# Altium schematic sheet CindyLou Main Board copy_2023-08-16.schdoc
size 600 x 358 mm
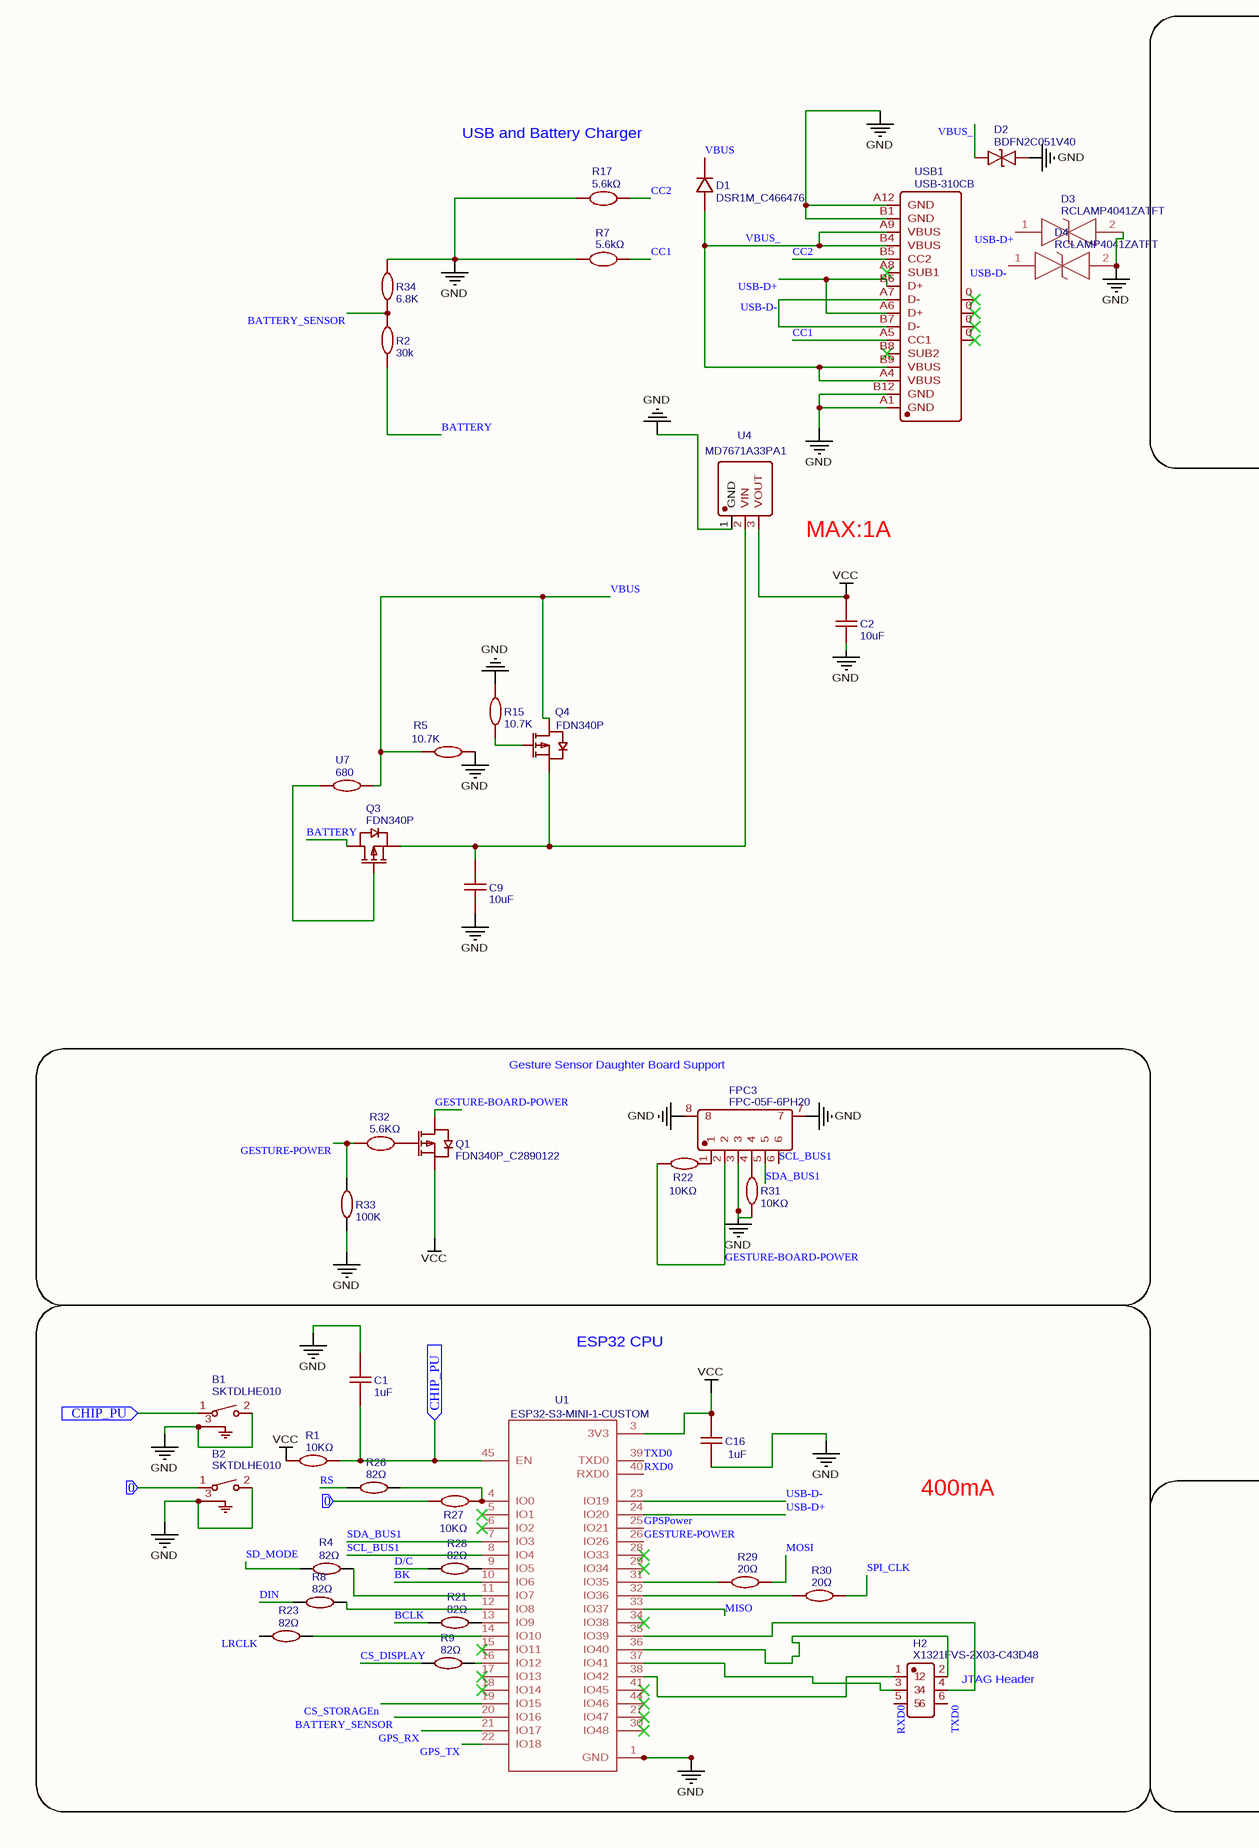
[diagram p0: CindyLou Main Board copy_2023-08-16.schdoc, left]
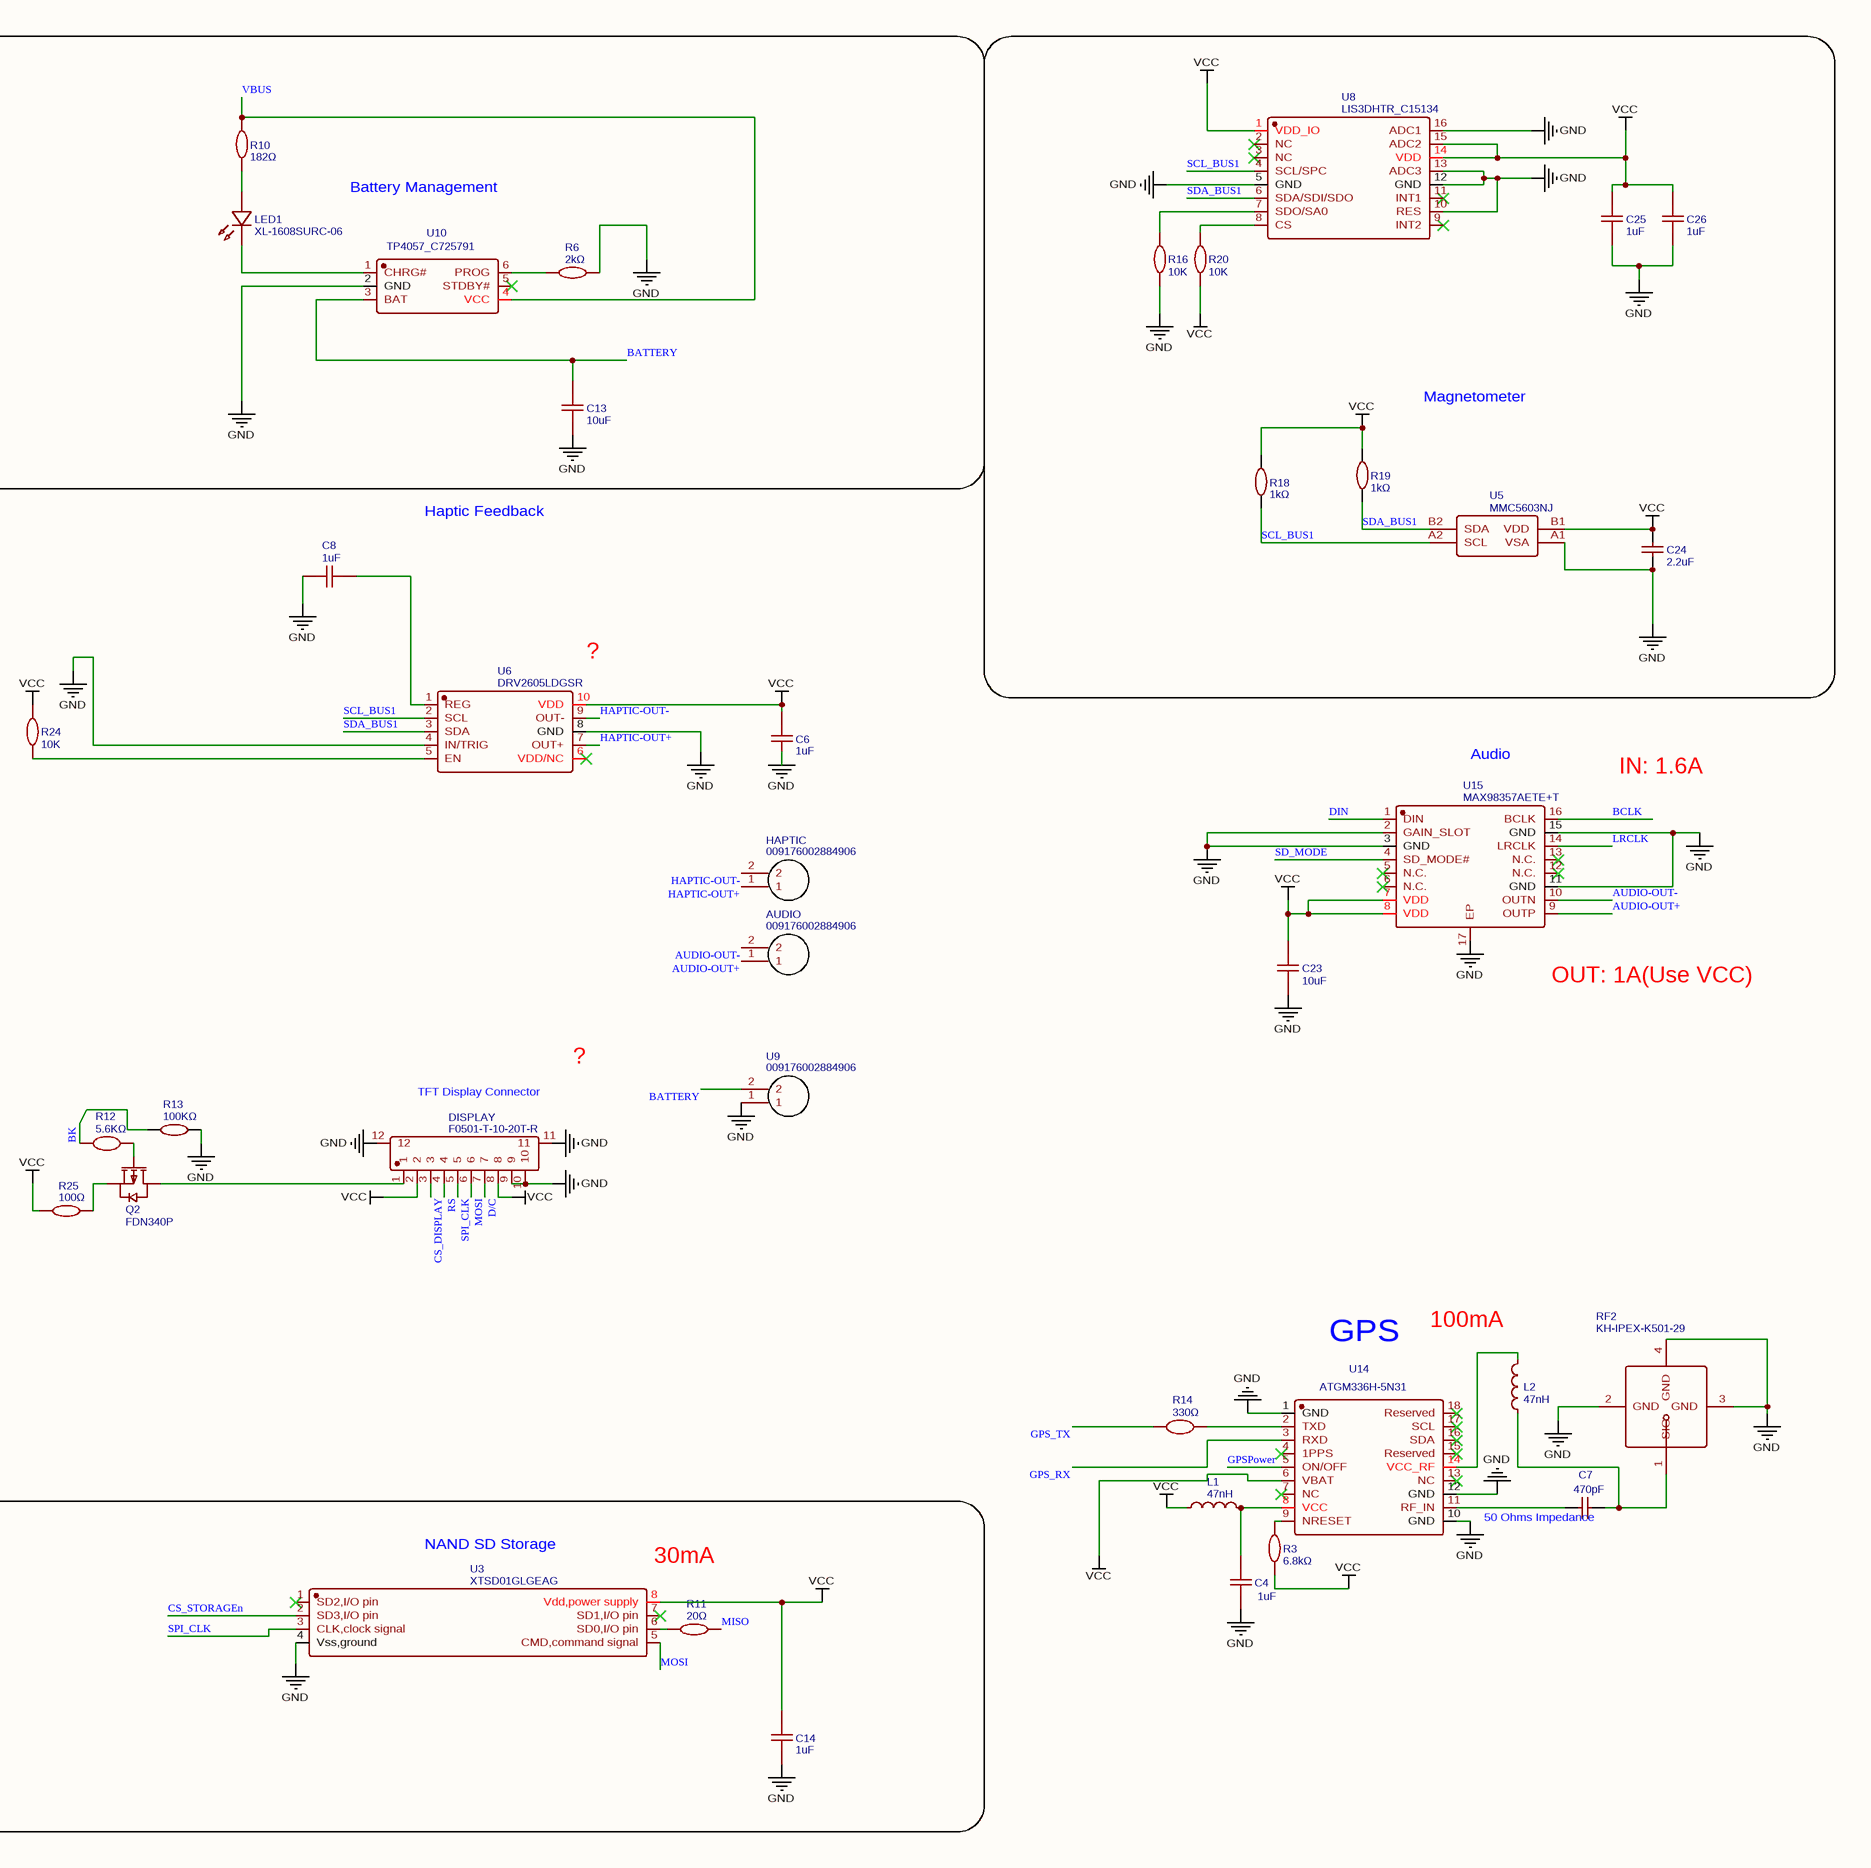
[diagram p1: CindyLou Main Board copy_2023-08-16.schdoc, right]

## Parts
AUDIO  009176002884906  [009176002884906]
B1  SKTDLHE010  [KEY-SMD_SKTDLHE010]
B2  SKTDLHE010  [KEY-SMD_SKTDLHE010]
C1  1uF  [C0402]
C2  10uF  [C0402]
C4  1uF  [C0402]
C6  1uF  [C0402]
C7  470pF  [C0201]
C8  1uF  [C0201]
C9  10uF  [C0402]
C13  10uF  [C0402]
C14  1uF  [C0402]
C16  1uF  [C0402]
C23  10uF  [C0402]
C24  2.2uF  [C0402]
C25  1uF  [C0402]
C26  1uF  [C0402]
D1  DSR1M_C466476  [SOD-123FL_L2.8-W1.8-LS3.7-RD]
D2  BDFN2C051V40  [DFN-SMD_L1.0-W0.6-BI]
D3  RCLAMP4041ZATFT  [RCLAMP4021ZATFT]
D4  RCLAMP4041ZATFT  [RCLAMP4021ZATFT]
DISPLAY  F0501-T-10-20T-R  [FPC-SMD_F0501-T-10-20T-R]
FPC3  FPC-05F-6PH20  [FPC-SMD_6P-P0.50_XUNPU_FPC-05F-6PH20]
H2  X1321FVS-2X03-C43D48  [HDR-SMD_6P-P1.27-V-F-R2-C3-LS4.8]
HAPTIC  009176002884906  [009176002884906]
L1  47nH  [L0201]
L2  47nH  [L0201]
LED1  XL-1608SURC-06  [LED0603-RD_RED]
Q1  FDN340P_C2890122  [SOT-23-3_L2.9-W1.3-P1.90-LS2.4-BR]
Q2  FDN340P  [SOT-23-3_L2.9-W1.3-P1.90-LS2.4-BR]
Q3  FDN340P  [SOT-23-3_L2.9-W1.3-P1.90-LS2.4-BR]
Q4  FDN340P  [SOT-23-3_L2.9-W1.3-P1.90-LS2.4-BR]
R1  10KΩ  [R0402]
R2  30k  [R0402]
R3  6.8kΩ  [R0402]
R4  82Ω  [R0201]
R5  10.7K  [R0402]
R6  2kΩ  [R0201]
R7  5.6kΩ  [R0201]
R8  82Ω  [R0201]
R9  82Ω  [R0201]
R10  182Ω  [R0402]
R11  20Ω  [R0201]
R12  5.6KΩ  [R0402]
R13  100KΩ  [R0402]
R14  330Ω  [R0201]
R15  10.7K  [R0402]
R16  10K  [R0402]
R17  5.6kΩ  [R0201]
R18  1kΩ  [R0402]
R19  1kΩ  [R0402]
R20  10K  [R0402]
R21  82Ω  [R0201]
R22  10KΩ  [R0402]
R23  82Ω  [R0201]
R24  10K  [R0402]
R25  100Ω  [R0402]
R26  82Ω  [R0201]
R27  10KΩ  [R0402]
R28  82Ω  [R0201]
R29  20Ω  [R0201]
R30  20Ω  [R0201]
R31  10KΩ  [R0402]
R32  5.6KΩ  [R0402]
R33  100K  [R0402]
R34  6.8K  [R0402]
RF2  KH-IPEX-K501-29  [ANT-SMD_KH-IPEX-K501-29]
U1  ESP32-S3-MINI-1-CUSTOM  [XCVR_ESP32-S3-MINI-1-N8-CUSTOM]
U3  XTSD01GLGEAG  [LGA-8_L6.0-W8.0-P1.27-BL]
U4  MD7671A33PA1  [SOT-89-3_L4.5-W2.5-P1.50-LS4.2-BR]
U5  MMC5603NJ  [FLIPCHIP-4_L0.8-W0.8-R2-C2-P0.40-TL]
U6  DRV2605LDGSR  [VSSOP-10_L3.0-W3.0-P0.50-LS4.9-BL]
U7  680  [R0402]
U8  LIS3DHTR_C15134  [LGA-16_L3.0-W3.0-P0.50-TL]
U9  009176002884906  [009176002884906]
U10  TP4057_C725791  [SOT-23-6_L2.9-W1.6-P0.95-LS2.8-BR]
U14  ATGM336H-5N31  [GPSM-SMD_ATGM336H-TR]
U15  MAX98357AETE+T  [TQFN-16_L3.0-W3.0-P0.50-BL-EP1.5]
USB1  USB-310CB  [USB-C-SMD_20P-P0.50-L6.5-W11.2]

## Blocks framed on the sheet
Battery Management: C13 LED1 R6 R10 U10
Magnetometer: C24-C26 R16 R18-R20 U5 U8
Gesture Sensor Daughter Board Support: FPC3 Q1 R22 R31-R33
400mA: B1 B2 C1 C16 H2 R1 R4 R8 R9 R21 R23 R26-R30 U1
30mA: C14 R11 U3

## Ports
0 (in), CHIP_PU (in)

## Nets
GND: B1.2 B1.3(GND) B2.2 B2.3(GND) C1.2 C2.2 C4.1 C6.1 C8.1 C9.1 C13.1 C14.1 C16.1 C23.1 C24.1 C25.1 C26.1 D2.2 D3.2 D4.2 DISPLAY.9 DISPLAY.10 DISPLAY.11 DISPLAY.12 FPC3.3 FPC3.7 FPC3.8 R5.2 R6.2 R7.1 R13.1 R15.2 R16.1 R17.2 R31.1 R33.1 R34.2 RF2.2(GND) RF2.3(GND) RF2.4(GND) U1.1(GND) U1.2(GND) U1.42(GND) U1.43(GND) U1.46(GND) U1.47(GND) U1.48(GND) U1.49(GND) U1.50(GND) U1.51(GND) U1.52(GND) U1.53(GND) U1.54(GND) U1.55(GND) U1.56(GND) U1.57(GND) U1.58(GND) U1.59(GND) U1.60(GND) U1.62(GND) U1.63(GND) U1.64(GND) U1.65(GND) U3.4(Vss,ground) U4.1(GND) U5.A1(VSA) U6.4(IN/TRIG) U6.8(GND) U8.5(GND) U8.10(RES) U8.12(GND) U8.13(ADC3) U8.16(ADC1) U9.1 U10.2(GND) U14.1(GND) U14.10(GND) U14.12(GND) U15.2(GAIN_SLOT) U15.3(GND) U15.11(GND) U15.15(GND) U15.17(EP) USB1.A1(GND) USB1.A12(GND) USB1.B1(GND) USB1.B12(GND)
VCC: C2.1 C6.2 C14.2 C16.2 C23.2 C24.2 C25.2 C26.2 DISPLAY.2 DISPLAY.8 L1.1 Q1.2(S) R1.1 R3.1 R18.2 R19.2 R20.1 R24.2 R25.1 U1.3(3V3) U3.8(Vdd,power_supply) U4.3(VOUT) U5.B1(VDD) U6.10(VDD) U8.1(VDD_IO) U8.14(VDD) U8.15(ADC2) U14.6(VBAT) U15.7(VDD) U15.8(VDD)
0: B2.1 R27.1 ; port 0
AUDIO-OUT+: AUDIO.1 U15.9(OUTP)
AUDIO-OUT-: AUDIO.2 U15.10(OUTN)
BATTERY: C13.2 Q3.3(D) R2.1 U9.2 U10.3(BAT)
BATTERY_SENSOR: R2.2 R34.1 U1.20(IO16)
BCLK: R21.1 U15.16(BCLK)
BK: R12.1 R13.2 U1.10(IO6)
CC1: R7.2 USB1.A5(CC1)
CC2: R17.1 USB1.B5(CC2)
CHIP_PU: B1.1 C1.1 R1.2 U1.45(EN) ; port CHIP_PU
CS_DISPLAY: DISPLAY.3 R9.1
CS_STORAGEn: U1.19(IO15) U3.2(SD3,I/O_pin)
D/C: DISPLAY.7 R28.1
DIN: R8.1 U15.1(DIN)
GESTURE-BOARD-POWER: FPC3.2 Q1.3(D) R22.1
GESTURE-POWER: R32.1 R33.2 U1.26(IO26)
GPS_RX: U1.21(IO17) U14.3(RXD)
GPS_TX: R14.1 U1.22(IO18)
GPSPower: U1.25(IO21) U14.5(ON/OFF)
HAPTIC-OUT+: HAPTIC.1 U6.7(OUT+)
HAPTIC-OUT-: HAPTIC.2 U6.9(OUT-)
LRCLK: R23.1 U15.14(LRCLK)
MISO: R11.2 U1.33(IO37)
MOSI: DISPLAY.6 R29.2 U3.5(CMD,command_signal)
RS: DISPLAY.4 R26.1
RXD0: H2.5 U1.40(RXD0)
SCL_BUS1: FPC3.6 R18.1 U1.8(IO4) U5.A2(SCL) U6.2(SCL) U8.4(SCL/SPC)
SD_MODE: R4.1 U15.4(SD_MODE#)
SDA_BUS1: FPC3.5 R19.1 U1.7(IO3) U5.B2(SDA) U6.3(SDA) U8.6(SDA/SDI/SDO)
SPI_CLK: DISPLAY.5 R30.2 U3.3(CLK,clock_signal)
TXD0: H2.6 U1.39(TXD0)
USB-D+: D3.1 U1.24(IO20) USB1.A6(D+) USB1.B6(D+)
USB-D-: D4.1 U1.23(IO19) USB1.A7(D-) USB1.B7(D-)
VBUS: D1.1(K) Q4.3(D) R5.1 R10.2 U7.1 U10.4(VCC)
VBUS_: D1.2(A) D2.1 USB1.A4(VBUS) USB1.A9(VBUS) USB1.B4(VBUS) USB1.B9(VBUS)
NetC4_2: C4.2 L1.2 U14.8(VCC)
NetC7_1: C7.1 U14.11(RF_IN)
NetC7_2: C7.2 L2.1 RF2.1(SIG)
NetC8_2: C8.2 U6.1(REG)
NetC9_2: C9.2 Q3.2(S) Q4.2(S) U4.2(VIN)
NetDISPLAY_1: DISPLAY.1 Q2.3(D)
NetFPC3_1: FPC3.1 R22.2
NetFPC3_4: FPC3.4 R31.2
NetH2_1: H2.1 U1.38(IO42)
NetH2_2: H2.2 U1.36(IO40)
NetH2_3: H2.3 U1.37(IO41)
NetH2_4: H2.4 U1.35(IO39)
NetL2_2: L2.2 U14.14(VCC_RF)
NetLED1_1: LED1.1(K) U10.1(CHRG#)
NetLED1_2: LED1.2(A) R10.1
NetQ1_1: Q1.1(G) R32.2
NetQ2_1: Q2.1(G) R12.2
NetQ2_2: Q2.2(S) R25.2
NetQ3_1: Q3.1(G) U7.2
NetQ4_1: Q4.1(G) R15.1
NetR3_2: R3.2 U14.9(NRESET)
NetR4_2: R4.2 U1.11(IO7)
NetR6_1: R6.1 U10.6(PROG)
NetR8_2: R8.2 U1.12(IO8)
NetR9_2: R9.2 U1.16(IO12)
NetR11_1: R11.1 U3.6(SD0,I/O_pin)
NetR14_2: R14.2 U14.2(TXD)
NetR16_2: R16.2 U8.7(SDO/SA0)
NetR20_2: R20.2 U8.8(CS)
NetR21_2: R21.2 U1.13(IO9)
NetR23_2: R23.2 U1.14(IO10)
NetR24_1: R24.1 U6.5(EN)
NetR26_2: R26.2 R27.2 U1.4(IO0)
NetR28_2: R28.2 U1.9(IO5)
NetR29_1: R29.1 U1.31(IO35)
NetR30_1: R30.1 U1.32(IO36)

Not connected (* = marked no-connect by the designer): U1 5(IO1)* 6(IO2)* 15(IO11)* 17(IO13)* 18(IO14)* 27(IO47)* 28(IO33)* 29(IO34)* 30(IO48)* 34(IO38)* 41(IO45)* 44(IO46)*; U3 1(SD2,I/O_pin)* 7(SD1,I/O_pin)*; U6 6(VDD/NC)*; U8 2(NC)* 3(NC)* 9(INT2)* 11(INT1)*; U10 5(STDBY#)*; U14 4(1PPS)* 7(NC)* 13(NC)* 15(Reserved)* 16(SDA)* 17(SCL)* 18(Reserved)*; U15 5(N.C.)* 6(N.C.)* 12(N.C.)* 13(N.C.)*; USB1 0* A8(SUB1)* B8(SUB2)*

## Notes on the sheet
- USB and Battery Charger
- MAX:1A
- Haptic Feedback
- (near U6) ?
- Audio
- IN: 1.6A
- (near U15) OUT: 1A(Use VCC)
- (near DISPLAY) TFT Display Connector
- ?
- ESP32 CPU
- GPS
- (near L2) 100mA
- (near U3) NAND SD Storage
- (near C7) 50 Ohms Impedance
- (near H2) JTAG Header

## Library data of the parts
AUDIO HAPTIC U9 = 009176002884906: Contributor: Av448; spicePre: U; spiceSymbolName: 009176002884906
B1 B2 = SKTDLHE010: Manufacturer: ALPS Electric; Contributor: LCSC; Supplier: LCSC; Supplier Part: C380198; Manufacturer Part: SKTDLHE010; JLCPCB Part Class: Extended Part; spicePre: S; spiceSymbolName: SKTDLHE010
C1 C4 C6 C14 C16 C25 C26 = 1uF: Manufacturer: muRata(村田); Manufacturer Part: GRT155R70J105KE01D; nameAlias: Capacitance; Contributor: LCSC; Supplier: LCSC; Supplier Part: C711581; JLCPCB Part Class: Extended Part; spicePre: C; spiceSymbolName: GRT155R70J105KE01D
C2 C9 C13 C23 = 10uF: Manufacturer: SAMSUNG(三星); Manufacturer Part: CL05A106MQ5NUNZ; nameAlias: Capacitance; Contributor: LCSC; Supplier: LCSC; Supplier Part: C2839440; JLCPCB Part Class: Extended Part; spicePre: C; spiceSymbolName: CL05A106MQ5NUNZ
C7 = 470pF: Manufacturer Part: 0201B471K500NT; Manufacturer: FH; nameAlias: Capacitance; Supplier: LCSC; Supplier Part: C55020; spicePre: C; spiceSymbolName: 0201B471K500NT_C55020
C8 = 1uF: Manufacturer: SANYEAR; Manufacturer Part: C0201X5R105M6R3NT; nameAlias: Capacitance; Contributor: LCSC; Supplier: LCSC; Supplier Part: C466604; spicePre: C; spiceSymbolName: C0201X5R105M6R3NT
C24 = 2.2uF: Manufacturer Part: GRM155R61A225KE95D; Manufacturer: MuRata; nameAlias: Capacitance; Supplier: LCSC; Supplier Part: C77002; spicePre: C; spiceSymbolName: GRM155R61A225KE95D
D1 = DSR1M_C466476: Manufacturer: High Diode(海德); Manufacturer Part: DSR1M; Contributor: LCSC; Supplier: LCSC; Supplier Part: C466476; JLCPCB Part Class: Extended Part; spicePre: D; spiceSymbolName: DSR1M_C466476
D2 = BDFN2C051V40: Manufacturer: BORN(伯恩半导体); Contributor: LCSC; Supplier Part: C152023; Supplier: LCSC; Manufacturer Part: BDFN2C051V40; JLCPCB Part Class: Extended Part; spicePre: D; spiceSymbolName: BDFN2C051V40
D3 D4 = RCLAMP4041ZATFT: Contributor: dparker; Supplier: Mouser; link: https://www.semtech.com/products/circuit-protection/low-capacitance/rclamp4021za; spicePre: D; spiceSymbolName: RCLAMP4021ZATFT
DISPLAY = F0501-T-10-20T-R: Manufacturer: XFCN(兴飞); Contributor: LCSC; Supplier: LCSC; Supplier Part: C481225; Manufacturer Part: F0501-T-10-20T-R; JLCPCB Part Class: Extended Part; spicePre: F; spiceSymbolName: F0501-T-10-20T-R
FPC3 = FPC-05F-6PH20: Manufacturer: XUNPU(讯普); Contributor: LCSC; Supplier: LCSC; Supplier Part: C2856796; Manufacturer Part: FPC-05F-6PH20; JLCPCB Part Class: Extended Part; spicePre: F; spiceSymbolName: FPC-05F-6PH20
H2 = X1321FVS-2X03-C43D48: Manufacturer: XKB Connectivity(中国星坤); Contributor: LCSC; Supplier: LCSC; Supplier Part: C2684731; Manufacturer Part: X1321FVS-2x03-C43D48; JLCPCB Part Class: Extended Part; spicePre: H; spiceSymbolName: X1321FVS-2X03-C43D48
L1 L2 = 47nH: Manufacturer: TDK; Manufacturer Part: MLG0603P47NHT000; nameAlias: Inductance; Contributor: LCSC; Supplier: LCSC; Supplier Part: C433019; spicePre: L; spiceSymbolName: MLG0603P47NHT000
LED1 = XL-1608SURC-06: Manufacturer: XINGLIGHT(成兴光); Contributor: LCSC; Supplier: LCSC; Supplier Part: C965799; Manufacturer Part: XL-1608SURC-06; JLCPCB Part Class: Extended Part; spicePre: L; spiceSymbolName: XL-1608SURC-06
Q1 = FDN340P_C2890122: Manufacturer: TECH PUBLIC(台舟); Contributor: LCSC; Supplier: LCSC; Supplier Part: C2890122; Manufacturer Part: FDN340P; spicePre: Q; spiceSymbolName: FDN340P_C2890122
Q2-Q4 = FDN340P: Manufacturer: TECH PUBLIC(台舟); Contributor: LCSC; Supplier: LCSC; Supplier Part: C2890122; Manufacturer Part: FDN340P; spicePre: Q; spiceSymbolName: FDN340P_C2890122
R1 R22 R27 R31 = 10KΩ: Manufacturer: Stackpole Elec; Manufacturer Part: RNCF0402BTE10K0; nameAlias: Resistance (Ohms); Contributor: LCSC; Supplier: LCSC; Supplier Part: C346559; JLCPCB Part Class: Extended Part; spicePre: R; spiceSymbolName: RNCF0402BTE10K0
R2 = 30k: Manufacturer: Susumu; Manufacturer Part: RR0510P-303-D; nameAlias: Resistance (Ohms); Contributor: LCSC; Supplier: Mouser; Supplier Part: 754-RR0510P-303D; spicePre: R; spiceSymbolName: PTFR0402B20K0N9
R3 = 6.8kΩ: Manufacturer: ResistorToday; Manufacturer Part: AECR0402F6K80K9; Resistance (Ohms): 6.8K; nameAlias: Resistance; Contributor: LCSC; Supplier: LCSC; Supplier Part: C352396; JLCPCB Part Class: Extended Part; spicePre: R; spiceSymbolName: AECR0402F6K80K9
R4 R8 R9 R21 R23 R26 R28 = 82Ω: Manufacturer: YAGEO; Manufacturer Part: AF0201JR-0782RL; nameAlias: Resistance (Ohms); Supplier: LCSC; Supplier Part: C144030; Resistance: 82Ω; spicePre: R; spiceSymbolName: AF0201JR-0782RL
R5 R15 = 10.7K: Manufacturer Part: SCR0402F10K7; nameAlias: Resistance (Ohms); Contributor: LCSC; Supplier: LCSC; Supplier Part: C3015977; JLCPCB Part Class: Extended Part; spicePre: R; spiceSymbolName: RC-02W1072FT
R6 = 2kΩ: Manufacturer: Uniroyal Elec; Manufacturer Part: 0201WMF2001TEE; Resistance (Ohms): 2K; nameAlias: Resistance; Contributor: LCSC; Supplier: LCSC; Supplier Part: C270358; JLCPCB Part Class: Extended Part; spicePre: R; spiceSymbolName: 0201WMF2001TEE
R7 R17 = 5.6kΩ: Manufacturer: UNI-ROYAL(Uniroyal Elec); Manufacturer Part: NQ01WMJ0562TEE; Contributor: LCSC; nameAlias: Resistance; Supplier: LCSC; Supplier Part: C965305; spicePre: R; spiceSymbolName: NQ01WMJ0562TEE
R10 = 182Ω: Manufacturer: Multicomp; Manufacturer Part: MCWR04X1820FTL; Resistance (Ohms): 182; nameAlias: Resistance; Contributor: LCSC; Supplier: LCSC; Supplier Part: C241158; JLCPCB Part Class: Extended Part; spicePre: R; spiceSymbolName: MCWR04X1820FTL
R11 = 20Ω: Manufacturer Part: AC0201FR-0720RL; nameAlias: Resistance (Ohms); Contributor: LCSC; Supplier: LCSC; Supplier Part: C226464; Resistance: 20Ω; spicePre: R; spiceSymbolName: RC0201FR-0720RL
R12 R32 = 5.6KΩ: Manufacturer Part: RMC04025.6K5%N; nameAlias: Resistance (Ohms); Contributor: LCSC; Supplier: LCSC; Supplier Part: C325562; spicePre: R; spiceSymbolName: 0402WGD5601TCE
R13 = 100KΩ: Manufacturer: YAGEO; Manufacturer Part: RC0402FR-07100KL; nameAlias: Resistance (Ohms); Supplier: LCSC; Supplier Part: C60491; JLCPCB Part Class: Extended Part; spicePre: R; spiceSymbolName: RC0402FR-07100KL
R14 = 330Ω: Manufacturer: UNI-ROYAL(Uniroyal Elec); Manufacturer Part: 0201WMJ0331TEE; Resistance (Ohms): 330; nameAlias: Resistance; Contributor: LCSC; Supplier: LCSC; Supplier Part: C473445; JLCPCB Part Class: Extended Part; spicePre: R; spiceSymbolName: 0201WMJ0331TEE
R16 R20 R24 = 10K: Manufacturer: ResistorToday; Manufacturer Part: AECR0402F10K0K9; nameAlias: Resistance (Ohms); Contributor: LCSC; Supplier: LCSC; Supplier Part: C328298; spicePre: R; spiceSymbolName: AECR0402F10K0K9
R18 R19 = 1kΩ: Manufacturer: UNI-ROYAL(厚声); Manufacturer Part: 0402WGJ0102TCE; nameAlias: Resistance; Resistance (Ohms): 1K; Supplier: LCSC; Supplier Part: C25543; JLCPCB Part Class: Extended Part; spicePre: R; spiceSymbolName: 0402WGJ0102TCE
R25 = 100Ω: Manufacturer: ResistorToday; Manufacturer Part: PTFR0402B100RN9; nameAlias: Resistance (Ohms); Contributor: LCSC; Supplier: LCSC; Supplier Part: C328416; JLCPCB Part Class: Extended Part; spicePre: R; spiceSymbolName: PTFR0402B100RN9
R29 R30 = 20Ω: nameAlias: Resistance (Ohms); Contributor: LCSC; Supplier: LCSC; Supplier Part: C226464; Resistance: 20Ω; spicePre: R; spiceSymbolName: RC0201FR-0720RL
R33 = 100K: Manufacturer: YAGEO; Manufacturer Part: RC0402FR-07100KL; nameAlias: Resistance (Ohms); Supplier: LCSC; Supplier Part: C60491; JLCPCB Part Class: Extended Part; spicePre: R; spiceSymbolName: RC0402FR-07100KL
R34 = 6.8K: Manufacturer: ResistorToday; Manufacturer Part: HPCR0402F6K80K9; Contributor: LCSC; nameAlias: Resistance (Ohms); Supplier: LCSC; Supplier Part: C365045; spicePre: U; spiceSymbolName: HPCR0402F6K80K9
RF2 = KH-IPEX-K501-29: Manufacturer: Shenzhen Kinghelm Elec; Contributor: LCSC; Supplier: LCSC; Supplier Part: C411563; Manufacturer Part: KH-IPEX-K501-29; JLCPCB Part Class: Extended Part; spicePre: R; spiceSymbolName: KH-IPEX-K501-29
U1 = ESP32-S3-MINI-1-CUSTOM: Contributor: Stefan Ravn van Overeem; spicePre: U; spiceSymbolName: ESP32-S3-MINI-1-CUSTOM
U3 = XTSD01GLGEAG: Manufacturer: XTX; Contributor: LCSC; Supplier: LCSC; Supplier Part: C558837; Manufacturer Part: XTSD01GLGEAG; JLCPCB Part Class: Extended Part; spicePre: U; spiceSymbolName: XTSD01GLGEAG
U4 = MD7671A33PA1: Manufacturer: 明达微; Contributor: LCSC; Supplier: LCSC; Supplier Part: C920513; Manufacturer Part: MD7671A33PA1; JLCPCB Part Class: Extended Part; spicePre: U; spiceSymbolName: MD7671A33PA1
U5 = MMC5603NJ: Manufacturer: MEMSIC(美新); Contributor: LCSC; Supplier: LCSC; Supplier Part: C404328; Manufacturer Part: MMC5603NJ; JLCPCB Part Class: Extended Part; spicePre: U; spiceSymbolName: MMC5603NJ
U6 = DRV2605LDGSR: Manufacturer: Texas Instruments; Contributor: LCSC; Supplier: LCSC; Supplier Part: C527464; Manufacturer Part: DRV2605LDGSR; JLCPCB Part Class: Extended Part; spicePre: U; spiceSymbolName: DRV2605LDGSR
U7 = 680: Manufacturer: ResistorToday; Manufacturer Part: HPCR0402F680RK9; Contributor: LCSC; nameAlias: Resistance (Ohms); Supplier: LCSC; Supplier Part: C365041; JLCPCB Part Class: Extended Part; spicePre: U; spiceSymbolName: HPCR0402F680RK9
U8 = LIS3DHTR_C15134: Manufacturer: ST(意法半导体); Supplier: LCSC; Manufacturer Part: LIS3DHTR; Supplier Part: C15134; JLCPCB Part Class: Extended Part; spicePre: U; spiceSymbolName: LIS3DHTR_C15134
U10 = TP4057_C725791: Manufacturer: UMW(Youtai Semiconductor Co., Ltd.); Manufacturer Part: TP4057; Contributor: LCSC; Supplier: LCSC; Supplier Part: C725791; JLCPCB Part Class: Extended Part; spicePre: U; spiceSymbolName: TP4057_C725791
U14 = ATGM336H-5N31: Manufacturer: ZHONGKEWEI; Supplier: LCSC; Manufacturer Part: ATGM336H-5N31; Supplier Part: C90770; JLCPCB Part Class: Extended Part; spicePre: U; spiceSymbolName: ATGM336H-5N31
U15 = MAX98357AETE+T: Manufacturer: MAXIM(美信); Contributor: LCSC; Supplier: LCSC; Supplier Part: C910544; Manufacturer Part: MAX98357AETE+T; JLCPCB Part Class: Extended Part; spicePre: U; spiceSymbolName: MAX98357AETE+T
USB1 = USB-310CB: Manufacturer: HOOYA; Contributor: LCSC; Supplier: LCSC; Supplier Part: C309373; Manufacturer Part: USB-310CB; spicePre: U; spiceSymbolName: USB-310CB